# EAGLE design Energy meter12 (EAGLE 7.0.0)
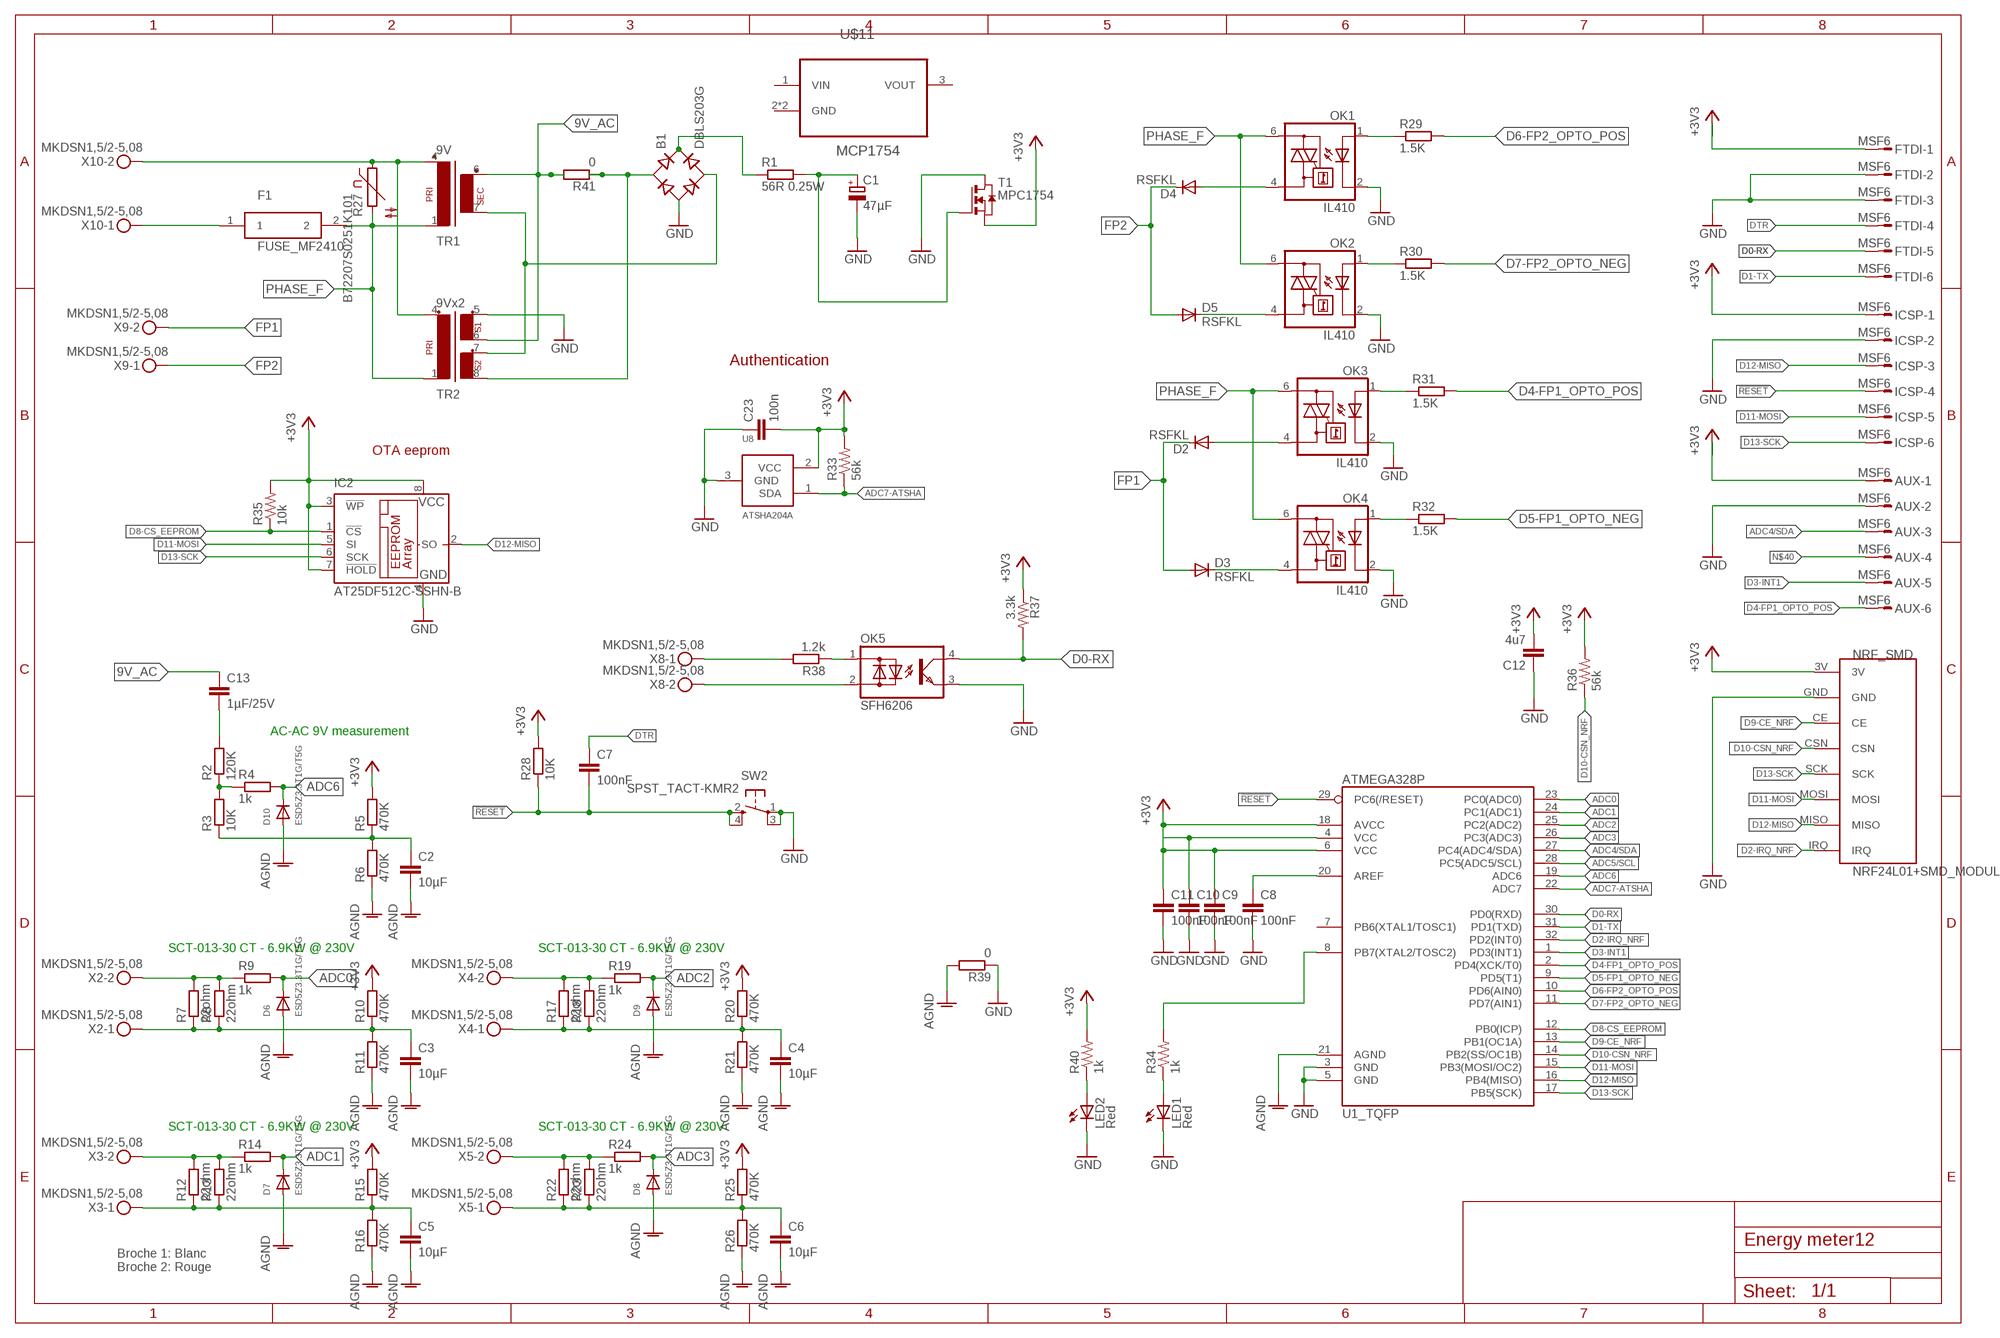
[diagram p0: schematic, sheet 1]

## Parts
AUX  MSF6  [MSF6]
B1  DBLS203G  [DBS]
C1  47µF  CPOL-EUD  [PANASONIC_D]
C2  10µF  C-EUC0805  [C0805]
C3  10µF  C-EUC0805  [C0805]
C4  10µF  C-EUC0805  [C0805]
C5  10µF  C-EUC0805  [C0805]
C6  10µF  C-EUC0805  [C0805]
C7  100nF  C-EUC0603  [C0603]
C8  100nF  C-EUC0603  [C0603]
C9  100nF  C-EUC0603  [C0603]
C10  100nF  C-EUC0603  [C0603]
C11  100nF  C-EUC0603  [C0603]
C12  4u7  CAP0805-CAP  [0805-CAP]
C13  1µF/25V  C-EUC0805  [C0805]
C23  100n  CAP0603-CAP  [0603-CAP]
D2  RSFKL  DIODE-SOD123  [SOD123]
D3  RSFKL  DIODE-SOD123  [SOD123]
D4  RSFKL  DIODE-SOD123  [SOD123]
D5  RSFKL  DIODE-SOD123  [SOD123]
D6  ESD5Z3.3T1G/T5G  DIODESOD-523  [SOD-523]
D7  ESD5Z3.3T1G/T5G  DIODESOD-523  [SOD-523]
D8  ESD5Z3.3T1G/T5G  DIODESOD-523  [SOD-523]
D9  ESD5Z3.3T1G/T5G  DIODESOD-523  [SOD-523]
D10  ESD5Z3.3T1G/T5G  DIODESOD-523  [SOD-523]
F1  FUSE_MF2410  [2410]
FTDI  MSF6  [MSF6]
IC2  AT25DF512C-SSHN-B  25AA080SN  [SO-08]
ICSP  MSF6  [MSF6]
LED1  Red  LED3MM  [LED3MM]
LED2  Red  LED3MM  [LED3MM]
NRF_SMD  NRF24L01+SMD_MODULE  [NRF24L01+SMD_MODULE]
OK1  IL410  [DIL06]
OK2  IL410  [DIL06]
OK3  IL410  [DIL06]
OK4  IL410  [DIL06]
OK5  SFH6206  [DIL4-SMD]
R1  56R 0.25W  R-EU_R1206  [R1206]
R2  120K  R-EU_R0603  [R0603]
R3  10K  R-EU_R0603  [R0603]
R4  1k  R-EU_R0603  [R0603]
R5  470K  R-EU_R0603  [R0603]
R6  470K  R-EU_R0603  [R0603]
R7  22ohm  R-EU_R1206  [R1206]
R8  22ohm  R-EU_0204/7  [0204/7]
R9  1k  R-EU_R0603  [R0603]
R10  470K  R-EU_R0603  [R0603]
R11  470K  R-EU_R0603  [R0603]
R12  22ohm  R-EU_R1206  [R1206]
R13  22ohm  R-EU_0204/7  [0204/7]
R14  1k  R-EU_R0603  [R0603]
R15  470K  R-EU_R0603  [R0603]
R16  470K  R-EU_R0603  [R0603]
R17  22ohm  R-EU_R1206  [R1206]
R18  22ohm  R-EU_0204/7  [0204/7]
R19  1k  R-EU_R0603  [R0603]
R20  470K  R-EU_R0603  [R0603]
R21  470K  R-EU_R0603  [R0603]
R22  22ohm  R-EU_R1206  [R1206]
R23  22ohm  R-EU_0204/7  [0204/7]
R24  1k  R-EU_R0603  [R0603]
R25  470K  R-EU_R0603  [R0603]
R26  470K  R-EU_R0603  [R0603]
R27  B72207S0251K101  [07S0251]
R28  10K  R-EU_R0603  [R0603]
R29  1.5K  R-EU_R0603  [R0603]
R30  1.5K  R-EU_R0603  [R0603]
R31  1.5K  R-EU_R0603  [R0603]
R32  1.5K  R-EU_R0603  [R0603]
R33  56k  RESISTOR0603-RES  [0603-RES]
R34  1k  RESISTOR0805-RES  [0805-RES]
R35  10k  RESISTOR0805-RES  [0805-RES]
R36  56k  RESISTOR0805-RES  [0805-RES]
R37  3.3k  RESISTOR0603-RES  [0603-RES]
R38  1.2k  R-EU_0204/7  [0204/7]
R39  0  R-EU_R0603  [R0603]
R40  1k  RESISTOR0805-RES  [0805-RES]
R41  0  R-EU_R0603  [R0603]
SW2  SPST_TACT-KMR2  [KMR2]
T1  MPC1754  NMOSSOT89  [SOT89]
TR1  9V  PT150901  [PT150901]
TR2  9Vx2  EE20-2  [EE20-2]
U1_TQFP  ATMEGA328P  ATMEGA328_SMT  [TQFP32-08]
U8  ATSHA204A  [SOT23]
U$11  MCP1754  [SOT89]
X2  MKDSN1,5/2-5,08  [MKDSN1,5/2-5,08]
X3  MKDSN1,5/2-5,08  [MKDSN1,5/2-5,08]
X4  MKDSN1,5/2-5,08  [MKDSN1,5/2-5,08]
X5  MKDSN1,5/2-5,08  [MKDSN1,5/2-5,08]
X8  MKDSN1,5/2-5,08  [MKDSN1,5/2-5,08]
X9  MKDSN1,5/2-5,08  [MKDSN1,5/2-5,08]
X10  MKDSN1,5/2-5,08  [MKDSN1,5/2-5,08]

## Nets
9V_AC: C13.1 R41.2 TR1.6(S3) TR2.6
!RESET: C7.2 ICSP.4 R28.1 SW2.2(S) SW2.4(S1) U1_TQFP.29(PC6(/RESET))
+3V3 [power]: AUX.1 C9.1 C10.1 C11.1 C12.2 C23.2 FTDI.1 IC2.3(!WP) IC2.7(!HOLD) IC2.8(VCC) ICSP.1 NRF_SMD.3V R5.2 R10.2 R15.2 R20.2 R25.2 R28.2 R33.2 R35.2 R36.2 R37.1 R40.2 T1.3(S) U1_TQFP.4(VCC) U1_TQFP.6(VCC) U1_TQFP.18(AVCC) U8.2(VCC)
ADC0: D6.K(C) R9.2 U1_TQFP.23(PC0(ADC0))
ADC1: D7.K(C) R14.2 U1_TQFP.24(PC1(ADC1))
ADC2: D9.K(C) R19.2 U1_TQFP.25(PC2(ADC2))
ADC3: D8.K(C) R24.2 U1_TQFP.26(PC3(ADC3))
ADC4/SDA: AUX.3 U1_TQFP.27(PC4(ADC4/SDA))
ADC5/SCL: U1_TQFP.28(PC5(ADC5/SCL))
ADC6: D10.K(C) R4.2 U1_TQFP.19(ADC6)
ADC7-ATSHA: R33.1 U1_TQFP.22(ADC7) U8.1(SDA)
AGND: C2.2 C3.2 C4.2 C5.2 C6.2 D6.A D7.A D8.A D9.A D10.A R6.1 R11.1 R16.1 R21.1 R26.1 R39.2 U1_TQFP.21(AGND)
D0-RX: FTDI.5 OK5.4(C) R37.2 U1_TQFP.30(PD0(RXD))
D1-TX: FTDI.6 U1_TQFP.31(PD1(TXD))
D2-IRQ_NRF: NRF_SMD.IRQ U1_TQFP.32(PD2(INT0))
D3-INT1: AUX.5 U1_TQFP.1(PD3(INT1))
D4-FP1_OPTO_POS: AUX.6 R31.2 U1_TQFP.2(PD4(XCK/T0))
D5-FP1_OPTO_NEG: R32.2 U1_TQFP.9(PD5(T1))
D6-FP2_OPTO_POS: R29.2 U1_TQFP.10(PD6(AIN0))
D7-FP2_OPTO_NEG: R30.2 U1_TQFP.11(PD7(AIN1))
D8-CS_EEPROM: IC2.1(!CS) R35.1 U1_TQFP.12(PB0(ICP))
D9-CE_NRF: NRF_SMD.CE U1_TQFP.13(PB1(OC1A))
D10-CSN_NRF: NRF_SMD.CSN R36.1 U1_TQFP.14(PB2(SS/OC1B))
D11-MOSI: IC2.5(SI) ICSP.5 NRF_SMD.MOSI U1_TQFP.15(PB3(MOSI/OC2))
D12-MISO: IC2.2(SO) ICSP.3 NRF_SMD.MISO U1_TQFP.16(PB4(MISO))
D13-SCK: IC2.6(SCK) ICSP.6 NRF_SMD.SCK U1_TQFP.17(PB5(SCK))
DTR: C7.1 FTDI.4
FP1 [220v]: D2.C D3.A X9.2
FP2 [220v]: D4.C D5.A X9.1
GND [gnd]: AUX.2 B1.- C1.- C8.2 C9.2 C10.2 C11.2 C12.1 C23.1 FTDI.2 FTDI.3 IC2.4(GND) ICSP.2 LED1.K(C) LED2.K(C) NRF_SMD.GND OK1.2(C) OK2.2(C) OK3.2(C) OK4.2(C) OK5.3(E) R39.1 SW2.1(P) SW2.3(P1) T1.2(D) T1.2@1(D) TR2.5 U1_TQFP.3(GND) U1_TQFP.5(GND) U8.3(GND)
N$1: B1.AC1 R41.1 TR2.8
N$2: C1.+ R1.2 T1.1(G)
N$3: R2.1 R3.2 R4.1
N$4: C2.1 R3.1 R5.1 R6.2
N$5 [220v]: D4.A OK1.4(A1)
N$6: R7.2 R8.2 R9.1 X2.2
N$7: C3.1 R7.1 R8.1 R10.1 R11.2 X2.1
N$8: LED2.A R40.1
N$9: R12.2 R13.2 R14.1 X3.2
N$10: C5.1 R12.1 R13.1 R15.1 R16.2 X3.1
N$11: R17.2 R18.2 R19.1 X4.2
N$12: C4.1 R17.1 R18.1 R20.1 R21.2 X4.1
N$13: R22.2 R23.2 R24.1 X5.2
N$14: C6.1 R22.1 R23.1 R25.1 R26.2 X5.1
N$15: C8.1 U1_TQFP.20(AREF)
N$16 [220v]: D2.A OK3.4(A1)
N$17 [220v]: D5.C OK2.4(A1)
N$18: OK1.1(A) R29.1
N$19: OK2.1(A) R30.1
N$20: R38.2 X8.1
N$21 [220v]: D3.C OK4.4(A1)
N$22: OK3.1(A) R31.1
N$23: OK4.1(A) R32.1
N$24: OK5.1(AC1) R38.1
N$25: OK5.2(AC2) X8.2
N$26: B1.+ R1.1
N$27: C13.2 R2.2
N$28: LED1.A R34.1
N$29: R34.2 U1_TQFP.8(PB7(XTAL2/TOSC2))
N$30 [220v]: R27.1 TR1.4(P2) TR2.4 X10.2
N$31 [gnd]: B1.AC2 TR1.7(S4) TR2.7
N$32 [220v]: F1.1 X10.1
N$40: AUX.4
PHASE_F [220v]: F1.2 OK1.6(A2) OK2.6(A2) OK3.6(A2) OK4.6(A2) R27.2 TR1.1 TR2.1
Unconnected: U1_TQFP.7(PB6(XTAL1/TOSC1)) U$11.1(VIN) U$11.2(GND) U$11.2.1(GND) U$11.3(VOUT)

## Notes on the sheet
- Authentication
- OTA eeprom
- AC-AC 9V measurement
- SCT-013-30 CT - 6.9KW @ 230V | SCT-013-30 CT - 6.9KW @ 230V
- SCT-013-30 CT - 6.9KW @ 230V | SCT-013-30 CT - 6.9KW @ 230V
- Broche 1: Blanc
  Broche 2: Rouge

## Library data of the parts
AUX FTDI ICSP = con-lumberg:MSF6: MSF CONNECTOR; OC_FARNELL: unknown; OC_NEWARK: unknown
B1 = rectifier:DB?*G: Single Phase 1.0 AMP Glass Passivated Bridge Rectifier Taiwan Semiconductor Co.,Ltd. - TSC Source: http://www.taiwansemi.com/TSCbig5/ezcatfiles/cust/img/img/db101g.pdf http://www.ts.com.tw/db/pictures/modules/PDT/PDT060207001/DBLS201G.pdf
C1 = rcl:CPOL-EU: POLARIZED CAPACITOR, European symbol
C2-C6 C13 = rcl:C-EU: CAPACITOR, European symbol
C7-C11 = resistor:C-EU: CAPACITOR, European symbol
C12 C23 = LowPowerLab:CAP: Capacitor Standard 0603 ceramic capacitor, and 0.1" leaded capacitor.
D2-D5 = diode:DIODE-: DIODE
D6-D10 = microbuilder:DIODE: Diode SMA Model Volts Amps Type Vf Vr Digikey # Notes SSA34-E3 40V 3A Schottky 480mV @ 3A 200uA @ 40V SSA34-E3/61TGITR-ND CDBA120-G 20V 1A Schottky 500mV @ 1A 500uA @ 20V 641-1014-6-ND REEL MBRA210 10V 2A Schottky 350mV @ 2A 700uA @ 10V MBRA210LT3 SOD-123 Model Volts Amps Type Vf Vr Order # Notes BAT54T1G 30V 200mA Schottky 800mV @ 200mA 2uA @ 25V BAT54T1GOSTR-ND B0530W 30V 500mA Schottky 430mV @ 500mA 130uA @ 30V B0530W-FDICT-ND REEL MBR120 1A 20V Schottky 340mV @ 1A MBR120VLSFT1GOSCT-ND SOD-323 Model Volts Amps Type Vf Vr Order # Notes PMEG2005EJ 20V 500mA Schottky 355mV @ 500mA 568-4110-1-ND ZLLS410 10V 570mA Schottky 380mV @ 570mA ZLLS410CT-ND 1N4148WS 75V 150mA Silicon/Simple 1V 1N4148WSFSCT-ND REEL SOD-523 Model Volts Amps Type Vf Vr Order # Notes BAT54XV2 30V 200mA Schottky 0.8V @ 100mA BAT54XV2CT-ND TB751S 30V 30mA Schottky RB751S-40TE61CT-ND SOT23-R/W (R = Solder Paste/Reflow Ovens, W = Hand-Soldering) Model Volts Amps Type Vf Vr Order # Notes BAT54FILM 40V 300mA Schottky 497-7162-1-ND
F1 = rollershutter:FUSE_MF2410
IC2 = microchip:25*: Serial EEPROM 4K/ 8K , SPI bus; MF: MICROCHIP; MPN: 25AA080/SN; OC_FARNELL: 1816072; OC_NEWARK: 92C7351
LED1 LED2 = led:LED: LED OSRAM: - CHIPLED LG R971, LG N971, LY N971, LG Q971, LY Q971, LO R971, LY R971 LH N974, LH R974 LS Q976, LO Q976, LY Q976 LO Q996 - Hyper CHIPLED LW Q18S LB Q993, LB Q99A, LB R99A - SideLED LS A670, LO A670, LY A670, LG A670, LP A670 LB A673, LV A673, LT A673, LW A673 LH A674 LY A675 LS A676, LA A676, LO A676, LY A676, LW A676 LS A679, LY A679, LG A679 - Hyper Micro SIDELED® LS Y876, LA Y876, LO Y876, LY Y876 LT Y87S - SmartLED LW L88C, LW L88S LB L89C, LB L89S, LG L890 LS L89K, LO L89K, LY L89K LS L896, LA L896, LO L896, LY L896 - TOPLED LS T670, LO T670, LY T670, LG T670, LP T670 LSG T670, LSP T670, LSY T670, LOP T670, LYG T670 LG T671, LOG T671, LSG T671 LB T673, LV T673, LT T673, LW T673 LH T674 LS T676, LA T676, LO T676, LY T676, LB T676, LH T676, LSB T676, LW T676 LB T67C, LV T67C, LT T67C, LS T67K, LO T67K, LY T67K, LW E67C LS E67B, LA E67B, LO E67B, LY E67B, LB E67C, LV E67C, LT E67C LW T67C LS T679, LY T679, LG T679 LS T770, LO T770, LY T770, LG T770, LP T770 LB T773, LV T773, LT T773, LW T773 LH T774 LS E675, LA E675, LY E675, LS T675 LS T776, LA T776, LO T776, LY T776, LB T776 LHGB T686 LT T68C, LB T68C - Hyper Mini TOPLED® LB M676 - Mini TOPLED Santana® LG M470 LS M47K, LO M47K, LY M47K Source: http://www.osram.convergy.de LUXEON: - LUMILED® LXK2-PW12-R00, LXK2-PW12-S00, LXK2-PW14-U00, LXK2-PW14-V00 LXK2-PM12-R00, LXK2-PM12-S00, LXK2-PM14-U00 LXK2-PE12-Q00, LXK2-PE12-R00, LXK2-PE12-S00, LXK2-PE14-T00, LXK2-PE14-U00 LXK2-PB12-K00, LXK2-PB12-L00, LXK2-PB12-M00, LXK2-PB14-N00, LXK2-PB14-P00, LXK2-PB14-Q00 LXK2-PR12-L00, LXK2-PR12-M00, LXK2-PR14-Q00, LXK2-PR14-R00 LXK2-PD12-Q00, LXK2-PD12-R00, LXK2-PD12-S00 LXK2-PH12-R00, LXK2-PH12-S00 LXK2-PL12-P00, LXK2-PL12-Q00, LXK2-PL12-R00 Source: www.luxeon.com KINGBRIGHT: KA-3528ASYC Source: www.kingbright.com
NRF_SMD = rollershutter:NRF24L01+SMD_MODULE
OK1-OK4 = optocoupler:IL410: SIEMENS OPTO COUPLER; MF: VISHAY/TELEFUNKEN; MPN: IL410; OC_FARNELL: 1045434; OC_NEWARK: 58K1715
OK5 = optocoupler-3-jcn:SFH620: Optocoupler, Phototransistor Output, AC Input Source: http://www.vishay.com/docs/83675/sfh620.pdf
R1 = resistor:R-EU_: RESISTOR, European symbol
R2-R26 R28-R32 R38 R39 R41 = rcl:R-EU_: RESISTOR, European symbol
R27 = Varistances:B72207S0251K101: VARISTOR
R33-R37 R40 = LowPowerLab:RESISTOR: Resistor Basic schematic elements and footprints for 0603, 1206, and PTH resistors.
SW2 = adafruit:SPST_TACT: SMT 6mm switch, EVQQ2 series http://www.ladyada.net/library/eagle
T1 = zetex:NMOSSOT89: MOS FET; OC_FARNELL: unknown; OC_NEWARK: unknown
TR1 = Transfo:PT150901: TRANSFORMER 1 primary winding, 1 secondary winding BLOCK; CONRAD: 1092836 - 62
TR2 = trafo:EE20-2: TRANSFORMER 1 primary winding, 2 secondary windings ERA
U1_TQFP = SparkFun-DigitalIC:ATMEGA328_SMT: 32-Pin Atmega328 part Commonly used on Arduino compatible boards Available in QFP and QFN packages TQFP is IC-09069 QFN is non-stock; PROD_ID: IC-09069
U8 = Multisensors_lib:ATSHA204A
U$11 = OpenEnergyMonitor:MCP1754
X2-X5 X8-X10 = con-phoenix-508:MKDSN1,5/2-5,08: MKDSN 1,5/ 2-5,08 Printklemme Nennstrom: 13,5 A Nennspannung: 250 V Rastermaß: 5,08 mm Polzahl: 2 Anschlussart: Schraubanschluss Montage: Löten Anschlussrichtung Leiter/Platine: 0 ° Artikelnummer: 1729128 Source: http://eshop.phoenixcontact.com .. 1729128.pdf

## Net classes
0 default: drill 0.015 mm, clearance 0.254 mm
1 power: width 0.305 mm, drill 0.6 mm, clearance 0.254 mm
2 gnd: width 0.305 mm, drill 0.6 mm, clearance 0.254 mm
3 220v: width 0.762 mm, drill 0.051 mm, clearance 0.762 mm

## Board
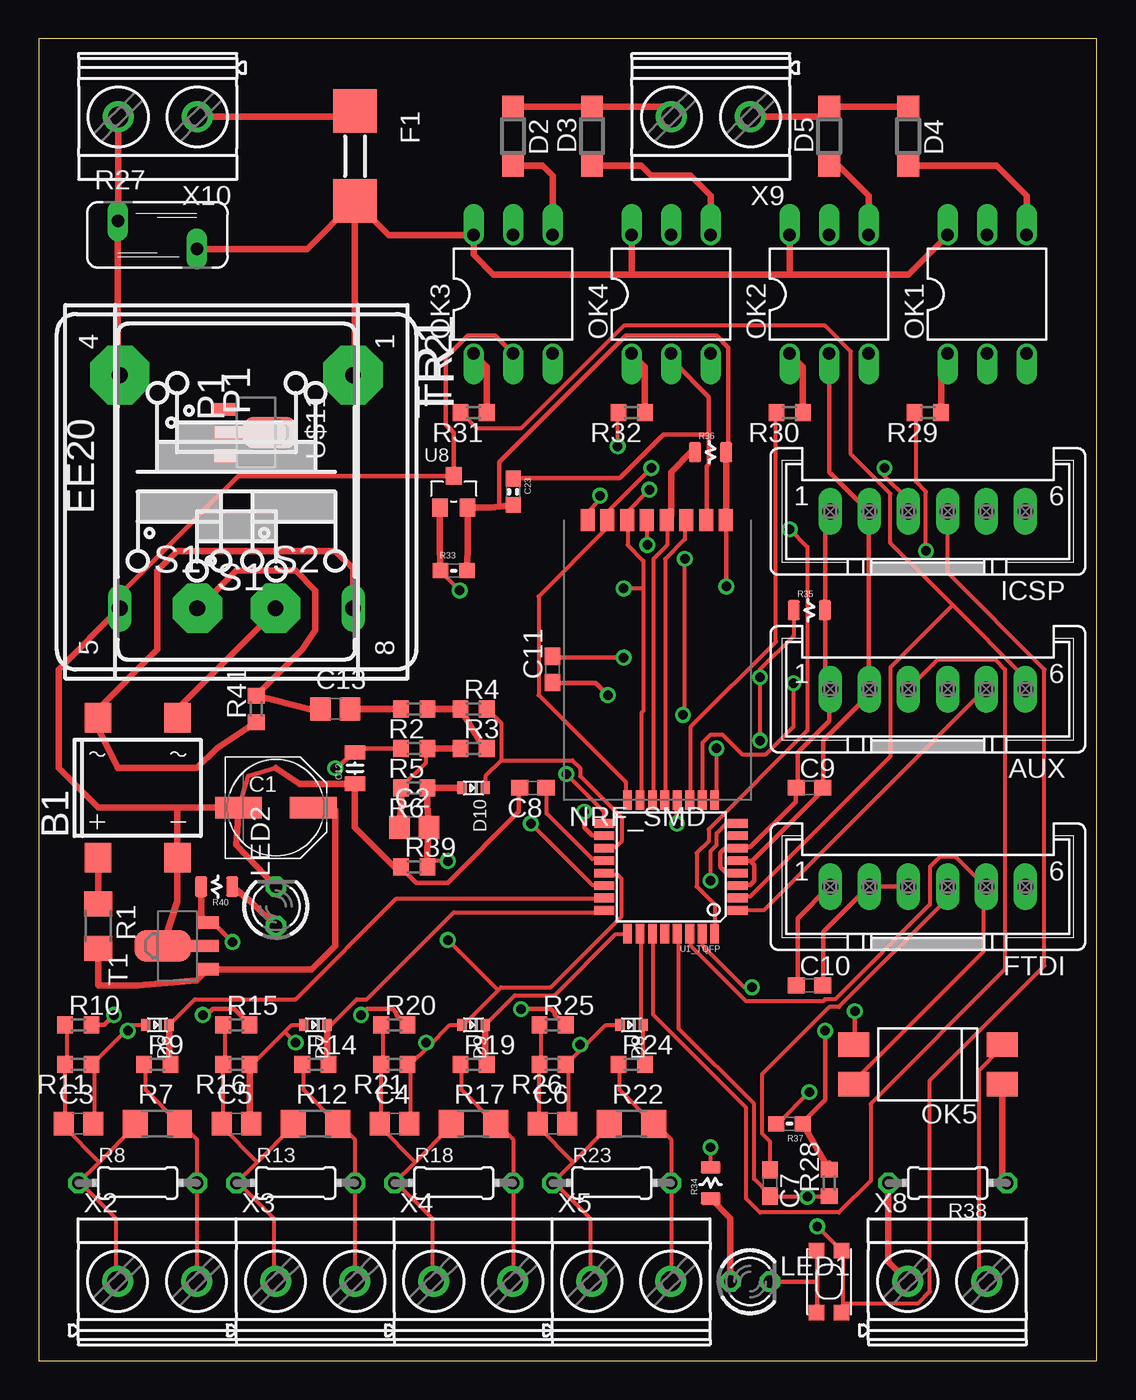
[diagram p1: board, top side]
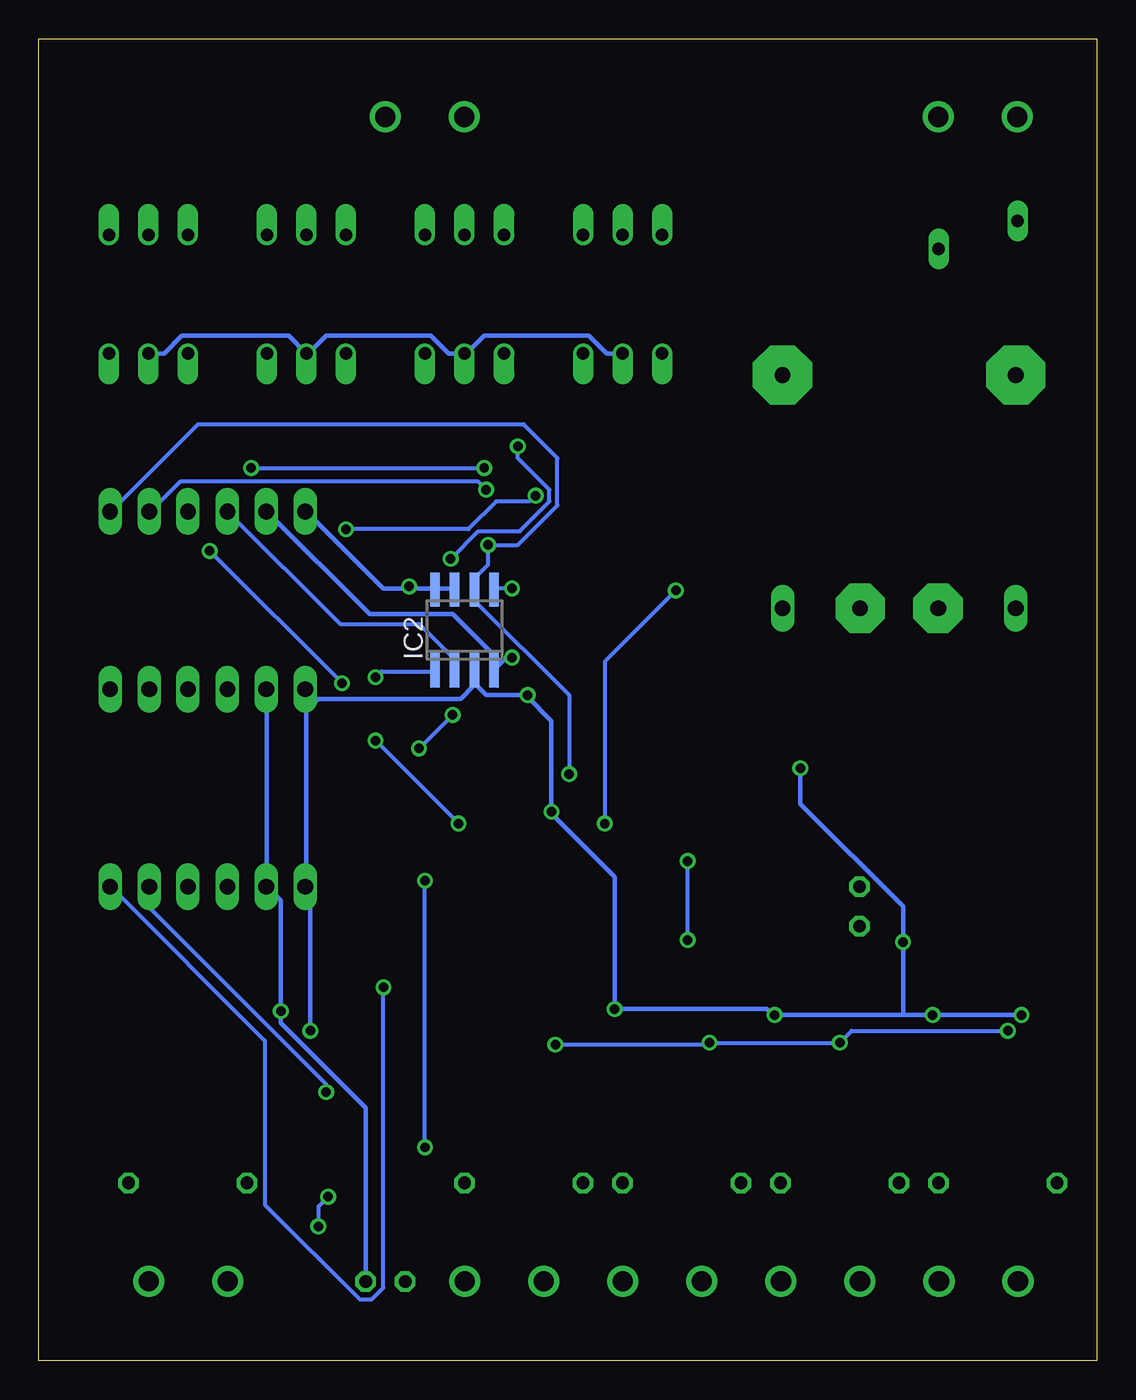
[diagram p2: board, bottom side, seen from below]

Size 68 x 85 mm. Coordinates in mm from the lower left corner, seen from the top.
Outline: 0,0 68,0 68,85 0,85 0,0
Copper layers (1*16): Top 0.035mm / dielectric 1.5mm / Bottom 0.035mm
Design rules "default *": minimum track width 10mil, minimum drill 24mil, track to track 8mil, track to pad 8mil, pad to pad 10mil, via to via 10mil, smd to smd 8mil, copper to edge 40mil, drill to drill 8mil, minimum pad ring 10mil, minimum via ring 8mil, stop-mask expansion 4mil, vias tented up to drill 0mil, thermal gap 10mil

### Footprints (pad centres in the part's own frame; a part is rotated, then mirrored left to right if it is on the bottom)
MSF6 = drill 1.016 long: 1 6.274,-2.54; 2 3.759,-2.54; 3 1.27,-2.54; 4 -1.27,-2.54; 5 -3.759,-2.54; 6 -6.274,-2.54
DBS = smd 1.7 x 1.9: + -2.55,-4.5; - 2.55,-4.5; AC1 -2.55,4.5; AC2 2.55,4.5
PANASONIC_D = smd 3 x 1.4: + 2.4,0; - -2.4,0
C0805 = smd 1.3 x 1.5: 1 -0.95,0; 2 0.95,0
C0603 = smd 1.1 x 1: 1 -0.85,0; 2 0.85,0
0805-CAP = smd 0.902 x 1.3: 1 -1,0; 2 1,0
0603-CAP = smd 1.016 x 0.965: 1 -0.85,0; 2 0.85,0
SOD123 = smd 1.4 x 1.4: A 1.9,0; C -1.9,0
SOD-523 = smd 0.8 x 0.6: A 0,-0.75; K 0,0.75
2410 = smd 2.8 x 2.8: 1 -2.9,0; 2 2.9,0
SO-08 = smd 0.6 x 2.2: 1 -1.905,-2.6; 2 -0.635,-2.6; 3 0.635,-2.6; 4 1.905,-2.6; 5 1.905,2.6; 6 0.635,2.6; 7 -0.635,2.6; 8 -1.905,2.6
LED3MM = drill 0.813 octagon: A -1.27,0; K 1.27,0
NRF24L01+SMD_MODULE = smd 0.9 x 1.4: 3V -4.8,-9.6; CE -2.26,-9.6; CSN -0.99,-9.6; GND -3.53,-9.6; IRQ 4.09,-9.6; MISO 2.82,-9.6; MOSI 1.55,-9.6; SCK 0.28,-9.6
DIL06 = drill 0.813 offset: 1 -2.54,-3.81; 2 0,-3.81; 3 2.54,-3.81; 4 2.54,3.81; 5 0,3.81; 6 -2.54,3.81
DIL4-SMD = smd 1.6 x 2: 1 -1.27,-4.77; 2 1.27,-4.77; 3 1.27,4.77; 4 -1.27,4.77
R1206 = smd 1.6 x 1.803: 1 -1.422,0; 2 1.422,0
R0603 = smd 1 x 1.1: 1 -0.85,0; 2 0.85,0
0204/7 = drill 0.813 octagon: 1 -3.81,0; 2 3.81,0
07S0251 = drill 0.8 long: 1 -0.9,-2.54; 2 0.9,2.54
0603-RES = smd 1.016 x 0.965: 1 -0.85,0; 2 0.85,0
0805-RES = smd 0.8 x 1.3: 1 -1,0; 2 1,0
KMR2 = smd 1 x 1: 1 2,0.8; 2 2,-0.8; 3 -2,0.8; 4 -2,-0.8
SOT89 = smd 0.8 x 1.4: 1 -1.499,-1.981; 3 1.499,-1.981 | smd 0.8 x 1.9: 2 0,-1.727 | smd 2.032 x 3.65: 2@1 0,0.94
PT150901 = drill 0.8 pad 3.81 octagon: 1 -7.5,7.5; 4 -7.5,-7.5 | drill 0.8 pad 3.175 octagon: 6 7.5,-2.5; 7 7.5,2.5
EE20-2 = drill 1.016 long: 1 -7.493,7.493; 4 -7.493,-7.493; 5 7.493,-7.493; 6 7.493,-2.515; 7 7.493,2.515; 8 7.493,7.493
TQFP32-08 = smd 1.27 x 0.559: 1 -4.293,2.8; 2 -4.293,2; 3 -4.293,1.2; 4 -4.293,0.4; 5 -4.293,-0.4; 6 -4.293,-1.2; 7 -4.293,-2; 8 -4.293,-2.8; 17 4.293,-2.8; 18 4.293,-2; 19 4.293,-1.2; 20 4.293,-0.4; 21 4.293,0.4; 22 4.293,1.2; 23 4.293,2; 24 4.293,2.8 | smd 0.559 x 1.27: 9 -2.8,-4.293; 10 -2,-4.293; 11 -1.2,-4.293; 12 -0.4,-4.293; 13 0.4,-4.293; 14 1.2,-4.293; 15 2,-4.293; 16 2.8,-4.293; 25 2.8,4.293; 26 2,4.293; 27 1.2,4.293; 28 0.4,4.293; 29 -0.4,4.293; 30 -1.2,4.293; 31 -2,4.293; 32 -2.8,4.293
SOT23 = smd 1.016 x 1.143: 1 -0.889,-1.016; 2 0.889,-1.016; 3 0,1.016
SOT89' = smd 0.8 x 1.4: 1 -1.499,-1.981; 3 1.499,-1.981 | smd 0.8 x 1.9: 2 0,-1.727 | smd 2 x 3.5: 2.1 0,0.889
MKDSN1,5/2-5,08 = drill 1.3 pad 2: 1 -2.561,0.025; 2 2.519,0.025

### Placement (x,y rotation side)
AUX  57.15,40.64 180 top
B1  6.35,36.83 0 top
C1  15.24,35.56 0 top
C2  24.13,34.29 0 top
C3  2.54,15.24 0 top
C4  22.86,15.24 0 top
C5  12.7,15.24 0 top
C6  33.02,15.24 0 top
C7  46.99,11.43 270 top
C8  31.75,36.83 180 top
C9  49.53,36.83 0 top
C10  49.53,24.13 0 top
C11  33.02,44.45 90 top
C12  20.32,38.1 90 top
C13  19.05,41.91 0 top
C23  30.48,55.88 270 top
D2  30.48,78.74 270 top
D3  35.56,78.74 90 top
D4  55.88,78.74 270 top
D5  50.8,78.74 90 top
D6  7.62,21.59 270 top
D7  17.78,21.59 270 top
D8  38.1,21.59 270 top
D9  27.94,21.59 270 top
D10  27.94,36.83 270 top
F1  20.32,77.47 270 top
FTDI  57.15,27.94 180 top
IC2  40.64,46.99 0 bottom
ICSP  57.15,52.07 180 top
LED1  45.72,5.08 0 top
LED2  15.24,29.21 90 top
NRF_SMD  39.37,44.45 180 top
OK1  60.96,68.58 0 top
OK2  50.8,68.58 0 top
OK3  30.48,68.58 0 top
OK4  40.64,68.58 0 top
OK5  57.15,19.05 90 top
R1  3.81,27.94 270 top
R2  24.13,41.91 180 top
R3  27.94,39.37 0 top
R4  27.94,41.91 0 top
R5  24.13,39.37 180 top
R6  24.13,36.83 180 top
R7  7.62,15.24 0 top
R8  6.35,11.43 0 top
R9  7.62,19.05 0 top
R10  2.54,21.59 0 top
R11  2.54,19.05 180 top
R12  17.78,15.24 0 top
R13  16.51,11.43 0 top
R14  17.78,19.05 0 top
R15  12.7,21.59 0 top
R16  12.7,19.05 180 top
R17  27.94,15.24 0 top
R18  26.67,11.43 0 top
R19  27.94,19.05 0 top
R20  22.86,21.59 0 top
R21  22.86,19.05 180 top
R22  38.1,15.24 0 top
R23  36.83,11.43 0 top
R24  38.1,19.05 0 top
R25  33.02,21.59 0 top
R26  33.02,19.05 180 top
R27  7.62,72.39 270 top
R28  50.8,11.43 90 top
R29  57.15,60.96 180 top
R30  48.26,60.96 180 top
R31  27.94,60.96 180 top
R32  38.1,60.96 180 top
R33  26.67,50.8 0 top
R34  43.18,11.43 90 top
R35  49.53,48.26 0 top
R36  43.18,58.42 0 top
R37  48.26,15.24 180 top
R38  58.42,11.43 180 top
R39  24.13,31.75 0 top
R40  11.43,30.48 180 top
R41  13.97,41.91 90 top
SW2  50.8,5.08 90 top
T1  8.89,26.67 90 top
TR1  12.7,55.88 270 top
TR2  12.7,55.88 270 top
U1_TQFP  40.64,31.75 180 top
U8  26.67,55.88 0 top
U$11  MCP1754  [SOT89']  13.97,59.69 270 top
X2  7.62,5.08 0 top
X3  17.78,5.08 0 top
X4  27.94,5.08 0 top
X5  38.1,5.08 0 top
X8  58.42,5.08 0 top
X9  43.18,80.01 180 top
X10  7.62,80.01 180 top

### Tracks (layer width: path | path; a pad name or v marks a point on that pad's centre or on a via)
9V_AC
  Top 0.254: TR2.6 10.29,48.39 TR1.6
  Top 0.406: TR1.6 10.28,48.38 10.29,48.39 12.7,50.8 16.51,50.8 17.78,49.53 17.78,46.99 16.93,45.72 R41.2 17.36,41.91 C13.1
!RESET  (via drill 0.61)
  Top 0.254: 51.69,3.68 51.69,6.99 SW2.2 51.56,7.11 v50.04,8.64 | 51.69,3.68 51.69,3.17 SW2.4 | R28.1 50.8,10.54 v49.4,10.54 46.99,10.54 C7.2 46.99,10.67 45.97,11.68 45.97,16.51 41.15,21.34 41.15,27.43 U1_TQFP.29 | ICSP.4 58.42,50.67 64.64,44.45 64.64,25.4 57.28,18.03 57.28,4.45 56.52,3.68 51.69,3.68
  Bottom 0.254: v50.04,8.64 50.04,9.91 v49.4,10.54
+3V3  (via drill 0.61)
  Top 0.305: R5.2 20.57,39.37 20.32,39.12 C12.2 20.19,39.12 19.18,38.1 v19.05,38.1 | R10.2 4.19,21.59 v4.83,22.23 | v10.54,22.23 10.79,22.23 11.18,22.61 12.57,22.61 13.59,21.59 R15.2 | v20.7,22.23 21.08,22.61 22.73,22.61 22.99,22.35 22.99,22.23 23.62,21.59 R20.2 | v30.99,22.61 32.89,22.61 33.15,22.35 33.15,22.23 33.78,21.59 R25.2 | v12.45,26.92 11.3,28.07 11.05,28.07 T1.3 | C10.1 48.77,24.13 48.77,28.45 50.8,30.48 FTDI.1 | v50.55,21.21 50.55,16.76 49.15,15.37 R37.1 | v36.58,42.8 35.81,43.56 33.02,43.56 C11.1 | v35.05,35.31 35.05,34.29 35.56,33.78 36.32,33.78 U1_TQFP.18 | U1_TQFP.4 44.83,31.37 44.2,31.37 43.81,31.75 43.81,32.64 44.07,32.89 44.83,32.89 U1_TQFP.6 44.96,33.02 45.72,33.02 48.64,35.94 48.64,36.83 C9.1 48.77,36.96 48.77,39.12 50.8,41.15 50.8,43.05 AUX.1 50.8,43.18 50.55,43.43 50.55,48.26 R35.2 50.55,48.39 50.55,54.36 50.8,54.61 ICSP.1 | v44.2,49.78 44.2,53.85 NRF_SMD.3V | 29.61,54.93 29.59,55.12 29.59,57.78 37.72,65.91 43.56,65.91 44.32,65.15 44.32,58.55 R36.2
  Top 0.406: 50.8,12.7 R28.2 R37.1 | R40.2 10.43,28.61 T1.3 | R33.2 27.56,52.11 U8.2 29.04,54.86 29.61,54.93 C23.2 | R36.2 NRF_SMD.3V
  Bottom 0.305: v4.83,22.23 v10.54,22.23 12.45,22.23 | 12.45,22.23 v20.7,22.23 20.83,22.23 21.21,22.61 v30.99,22.61 30.99,31.11 35.05,35.18 v35.05,35.31 35.05,41.15 36.58,42.67 v36.58,42.8 39.24,42.8 40.01,43.56 IC2.3 40.01,43.43 40.89,42.55 50.16,42.55 50.8,43.18 AUX.1 50.16,42.42 50.8,41.78 50.8,30.61 FTDI.1 50.8,30.48 50.55,30.23 v50.55,21.21 | 12.45,22.23 v12.45,26.92 12.45,29.21 19.05,35.81 v19.05,38.1 | IC2.7 41.27,49.66 42.55,49.66 IC2.8 42.67,49.66 44.2,49.66 | 44.2,49.66 45.85,49.66 50.8,54.61 ICSP.1 | v44.2,49.78 44.2,49.66
ADC0
  Top 0.254: U1_TQFP.23 36.32,29.72 22.99,29.72 16.51,23.24 10.03,23.24 8.51,21.72 D6.K
  Top 0.406: D6.K 8.37,19.15 R9.2
ADC1
  Top 0.254: U1_TQFP.24 36.32,28.83 26.67,28.83 21.08,23.24 20.45,23.24 18.67,21.46 D7.K
  Top 0.406: D7.K 18.53,19.15 R14.2
ADC2
  Top 0.254: U1_TQFP.25 37.72,27.43 37.08,27.43 33.15,23.5 30.61,23.5 28.83,21.72 D9.K
  Top 0.406: D9.K 28.69,19.15 R19.2
ADC3
  Top 0.254: R24.2 38.86,19.05 38.86,21.59 D8.K 38.73,21.59 38.73,27.43 U1_TQFP.26
ADC4/SDA
  Top 0.254: AUX.3 57.78,45.09 61.47,45.09 62.1,44.45 62.1,25.15 53.47,16.51 53.47,11.56 51.44,9.53 46.35,9.53 45.47,10.41 45.47,16.26 39.5,22.23 39.5,27.43 U1_TQFP.27
ADC6
  Top 0.254: 29.72,38.61 28.7,37.59 28.7,36.83 D10.K | 29.72,38.61 29.72,41.02 28.83,41.91 R4.2 | 29.72,38.61 34.29,38.61 34.8,38.1 34.8,37.59 37.47,34.92 37.47,33.4 37.08,33.02 36.45,33.02 U1_TQFP.19
ADC7-ATSHA  (via drill 0.61)
  Top 0.254: v31.62,34.54 35.56,30.61 36.32,30.61 U1_TQFP.22 | v27.05,49.53 25.91,50.67 R33.1
  Top 0.406: U8.1 25.78,52.11 R33.1
  Bottom 0.254: v31.62,34.54 31.62,44.96 v27.05,49.53
AGND  (via drill 0.61)
  Top 0.254: 23.88,19.05 23.88,15.24 C4.2 | D8.A 36.45,21.59 34.99,20.13 | 34.99,20.13 33.91,19.05 R26.1 34.04,19.05 34.04,15.24 C6.2 | 5.65,21.27 3.43,19.05 R11.1 3.56,19.05 3.56,15.24 C3.2 | 5.65,21.27 5.97,21.59 6.86,21.59 D6.A | D7.A 16.26,21.59 15.81,21.14 | 15.81,21.14 13.72,19.05 R16.1 | 23.88,19.05 25.08,20.26 | 25.08,20.26 26.42,21.59 D9.A 27.3,21.59 29.53,23.81 | 23.88,19.05 R21.1 | 29.53,23.81 29.72,24 32.89,24 37.47,28.57 37.47,30.99 37.21,31.24 36.45,31.24 U1_TQFP.21 | v16.51,20.45 15.81,21.14 | 25.08,20.26 v24.89,20.45 | v26.29,32.13 25.15,32.13 R39.2 | 29.53,23.81 v26.29,27.05 | v5.71,21.21 5.65,21.27 | v34.8,20.32 34.99,20.13
  Top 0.406: D10.A R6.1 24.98,35.66 C2.2 24.98,32.92 R39.2 | R16.1 13.55,15.34 C5.2
  Bottom 0.254: v26.29,27.05 v26.29,32.13 | v5.71,21.21 15.75,21.21 v16.51,20.45 v24.89,20.45 25.02,20.32 v34.8,20.32
D0-RX  (via drill 0.61)
  Top 0.254: v49.53,17.27 47.5,15.24 R37.2 | U1_TQFP.30 41.91,27.43 41.91,26.67 45.47,23.11 50.42,23.11 50.55,23.24 51.18,23.24 57.28,29.34 57.28,31.75 57.91,32.38 58.93,32.38 60.83,30.48 FTDI.5 60.71,30.48 60.71,26.29 52.45,18.03 52.45,17.78 OK5.4
  Bottom 0.254: v49.53,17.27 49.53,17.78 60.83,29.08 60.83,30.48 FTDI.5
D1-TX  (via drill 0.61)
  Top 0.254: v45.85,24 45.34,24 42.67,26.67 42.67,27.43 U1_TQFP.31
  Bottom 0.254: v45.85,24 45.85,4.7 46.61,3.94 47.37,3.94 53.47,10.03 53.47,20.57 63.37,30.48 FTDI.6
D2-IRQ_NRF  (via drill 0.61)
  Top 0.254: v48.26,53.47 49.4,52.32 49.4,40.51 43.05,34.16 43.05,33.4 42.29,32.64 42.29,30.48 43.43,29.34 43.43,27.56 U1_TQFP.32 | v36.07,55.63 36.07,55.37 35.31,54.61 35.31,54.1 NRF_SMD.IRQ
  Bottom 0.254: v48.26,53.47 40.39,53.47 38.61,55.24 36.45,55.24 v36.07,55.63
D3-INT1
  Top 0.254: U1_TQFP.1 44.96,28.96 46.61,28.96 60.83,43.18 AUX.5
D4-FP1_OPTO_POS
  Top 0.254: 58.74,48.58 63.37,43.94 63.37,43.18 AUX.6 | 58.74,48.58 54.74,52.58 54.74,55.75 52.2,58.29 52.2,64.9 50.55,66.55 37.59,66.55 30.99,59.94 28.19,59.94 27.18,60.96 R31.2 | 58.74,48.58 54.74,44.58 54.74,38.86 45.72,29.84 44.96,29.84 U1_TQFP.2
D5-FP1_OPTO_NEG  (via drill 0.61)
  Top 0.254: v37.21,58.8 37.21,60.96 R32.2 | v41.53,51.56 41.53,41.66 v41.4,41.53 | v43.56,39.37 43.56,36.07 U1_TQFP.9
  Bottom 0.254: v37.21,58.8 37.21,58.04 35.18,56.01 35.18,55.24 37.08,53.34 39.75,53.34 v41.53,51.56 | v43.56,39.37 v41.4,41.53
D6-FP2_OPTO_POS  (via drill 0.61)
  Top 0.254: v57.02,52.07 57.02,55.88 56.39,56.52 56.39,60.96 R29.2 | v48.51,43.56 48.51,40.77 46.74,38.99 45.21,38.99 43.94,40.26 43.18,40.26 42.67,39.75 42.67,36.07 U1_TQFP.10
  Bottom 0.254: v48.51,43.56 v57.02,52.07
D7-FP2_OPTO_NEG
  Top 0.254: R30.2 47.37,60.96 47.37,46.23 41.91,40.77 41.91,36.07 U1_TQFP.11
D8-CS_EEPROM  (via drill 0.61)
  Top 0.254: v41.02,34.54 41.02,35.94 U1_TQFP.12 | v46.35,39.88 v46.35,43.94 46.35,44.45 48.51,46.61 48.51,48.26 R35.1
  Bottom 0.254: v46.35,39.88 v41.02,34.54 | v46.35,43.94 45.97,44.32 42.55,44.32 IC2.1
D9-CE_NRF
  Top 0.254: U1_TQFP.13 40.26,36.07 40.26,51.56 41.53,52.83 41.53,53.98 NRF_SMD.CE
D10-CSN_NRF
  Top 0.254: U1_TQFP.14 39.5,36.07 39.5,51.56 40.39,52.45 40.39,53.85 NRF_SMD.CSN
  Top 0.406: R36.1 41.91,58.42 40.64,57.15 40.64,54.33 NRF_SMD.CSN
D11-MOSI  (via drill 0.61)
  Top 0.254: 38.86,49.66 38.86,51.44 37.85,52.45 37.85,53.98 NRF_SMD.MOSI 37.85,54.1 37.85,54.61 v39.24,56.01 | 38.86,49.66 38.86,41.78 38.73,41.66 38.73,36.07 U1_TQFP.15 | 38.86,49.66 v37.59,49.66
  Bottom 0.254: v37.59,49.66 38.73,49.66 IC2.5 | v39.24,56.01 39.75,56.52 58.93,56.52 60.83,54.61 ICSP.5
D12-MISO  (via drill 0.61)
  Top 0.254: U1_TQFP.16 37.72,36.07 37.72,37.21 32.13,42.8 32.13,49.15 36.45,53.47 36.45,53.98 NRF_SMD.MISO 36.58,54.1 36.58,54.61 v39.37,57.4 | v54.36,57.4 54.36,56.9 55.88,55.37 ICSP.3
  Bottom 0.254: IC2.2 41.27,45.09 43.56,47.37 48.64,47.37 ICSP.3 | v54.36,57.4 v39.37,57.4
D13-SCK  (via drill 0.61)
  Top 0.254: v33.91,37.72 36.32,35.31 36.32,34.67 U1_TQFP.17 | v39.12,52.45 39.12,53.98 NRF_SMD.SCK
  Bottom 0.254: v33.91,37.72 33.91,42.8 40.01,48.9 IC2.6 40.01,50.29 39.12,51.18 v39.12,52.45 37.21,52.45 34.67,54.99 34.67,58.04 36.83,60.2 57.78,60.2 63.37,54.61 ICSP.6
DTR
  Top 0.254: C7.1 46.99,14.1 46.48,14.61 46.48,18.41 50.8,22.73 51.44,22.73 58.42,29.72 FTDI.4
FP1
  Top 0.406: D2.C D3.A 40.01,80.64 X9.2
FP2
  Top 0.406: X9.1 50.15,79.98 D5.A D4.C
GND  (via drill 0.61)
  Top 0.305: 22.86,31.75 R39.1 23.37,31.62 24.26,30.73 26.29,30.73 30.86,35.31 30.86,36.83 C8.2 | 15.24,38.1 13.46,37.59 C1.- | 43.05,59.56 43.05,61.98 40.77,64.26 40.77,64.64 OK4.2 | 43.05,59.56 43.05,57.66 42.93,57.53 42.93,54.1 NRF_SMD.GND | OK3.2 29.34,65.91 27.56,65.91 26.16,64.52 26.16,60.2 26.67,59.69 U8.3 12.83,56.9 5.33,49.4 5.33,48.51 TR2.5 | 50.04,5.08 50.04,6.99 SW2.1 | 50.04,5.08 50.04,3.17 SW2.3 | LED1.K 50.04,5.08 | C10.2 50.42,24.13 50.42,27.56 53.34,30.48 FTDI.2 FTDI.3 | v52.45,22.48 52.45,20.32 OK5.3 | 45.78,32.07 45.72,32.13 44.96,32.13 U1_TQFP.5 | 45.78,32.07 45.97,31.88 45.97,30.86 45.72,30.61 44.96,30.61 U1_TQFP.3 | 45.78,32.07 50.42,36.7 C9.2 50.42,36.83 50.42,39.88 53.34,42.8 53.34,43.18 AUX.2 53.34,43.31 53.34,54.48 ICSP.2 53.34,54.61 50.8,57.15 OK2.2 | 43.05,59.56 40.13,59.56 37.34,56.77 30.48,56.77 C23.1 | v37.59,45.21 33.02,45.21 C11.2
  Top 0.406: TR2.5 1.27,44.45 1.27,38.1 3.81,35.56 7.62,35.56 | 7.62,35.56 C1.- 12.7,33.16 LED2.K | 7.62,35.56 8.9,35.55 B1.- 8.9,29.53 T1.2@1 | 15.24,38.1 16.78,37.1 C12.1 20.32,34.29 22.86,31.75
  Bottom 0.305: LED1.K 46.99,16.26 52.45,21.72 v52.45,22.48 52.45,29.59 53.34,30.48 FTDI.2 53.34,30.61 53.34,43.18 AUX.2 | v37.59,45.21 37.97,45.21 38.29,44.9 | 38.29,44.9 38.73,44.45 IC2.4 | OK1.2 59.94,64.77 58.8,65.91 51.94,65.91 OK2.2 50.67,64.77 49.53,65.91 42.8,65.91 41.66,64.77 OK4.2 40.51,64.77 39.37,65.91 32.64,65.91 31.5,64.77 OK3.2 | 38.29,44.9 41.4,48.01 46.74,48.01 53.34,54.61 ICSP.2
N$1
  Top 0.254: 3.81,41.91 3.81,41.53 B1.AC1
  Top 0.406: B1.AC1 3.8,40.65 5.08,38.1 10.16,38.1 11.43,39.37 R41.1 | TR2.8 20.19,50.93 19.05,52.07 8.89,52.07 7.62,50.8 7.62,45.72 3.81,41.91
N$2
  Top 0.406: R1.2 3.81,24.13 6.35,24.13 10.16,24.46 T1.1 17.55,25.17 19.05,26.67 19.05,35.42 C1.+
N$3
  Top 0.406: R2.1 R4.1 28.36,39.8 R3.2
N$4
  Top 0.254: R5.1 24.89,39.24 24.89,38.48 23.37,36.96 R6.2
  Top 0.406: R6.2 23.28,35.66 C2.1 | R3.1 R5.1
N$5
  Top 0.406: D4.A 61.59,76.84 63.5,74.93 OK1.4
N$6
  Top 0.254: R9.1 6.86,19.05 6.86,17.4 9.02,15.24 R7.2 9.14,15.24 10.16,14.22 R8.2 10.16,5.21 X2.2
N$7
  Top 0.254: R10.1 1.78,21.59 1.78,19.05 R11.2 1.65,19.05 1.65,15.24 | 3.87,12.76 R8.1 2.67,11.43 4.95,9.14 4.95,5.21 X2.1 | 3.87,12.76 6.1,14.99 6.1,15.24 R7.1 | 1.65,15.24 1.65,14.99 3.87,12.76 | 1.65,15.24 C3.1
N$8
  Top 0.406: R40.1 13.7,29.48 LED2.A
N$9
  Top 0.254: R14.1 17.02,19.05 17.02,17.4 19.18,15.24 R12.2 19.3,15.24 20.32,14.22 R13.2 20.32,5.21 X3.2
N$10
  Top 0.254: R15.1 11.94,21.59 11.94,19.05 R16.2 11.81,19.05 11.81,15.24 | 14.03,12.76 R13.1 12.83,11.43 15.11,9.14 15.11,5.21 X3.1 | 14.03,12.76 16.26,14.99 16.26,15.24 R12.1 | 11.81,15.24 11.81,14.99 14.03,12.76 | 11.81,15.24 C5.1
N$11
  Top 0.254: R19.1 27.18,19.05 27.18,17.4 29.34,15.24 R17.2 29.46,15.24 30.48,14.22 R18.2 30.48,5.21 X4.2
N$12
  Top 0.254: R20.1 22.1,21.59 22.1,19.05 R21.2 21.97,19.05 21.97,15.24 | 24.19,12.76 R18.1 22.99,11.43 25.27,9.14 25.27,5.21 X4.1 | 24.19,12.76 26.42,14.99 26.42,15.24 R17.1 | 21.97,15.24 21.97,14.99 24.19,12.76 | 21.97,15.24 C4.1
N$13
  Top 0.254: R24.1 37.34,19.05 37.34,17.4 39.5,15.24 R22.2 39.62,15.24 40.64,14.22 R23.2 40.64,5.21 X5.2
N$14
  Top 0.254: R25.1 32.26,21.59 32.26,19.05 R26.2 32.13,19.05 32.13,15.24 | 34.35,12.76 R23.1 33.15,11.43 35.43,9.14 35.43,5.21 X5.1 | 34.35,12.76 36.58,14.99 36.58,15.24 R22.1 | 32.13,15.24 32.13,14.99 34.35,12.76 | 32.13,15.24 C6.1
N$15
  Top 0.254: C8.1 32.64,36.83 32.64,35.18 35.56,32.26 36.32,32.26 U1_TQFP.20
N$16
  Top 0.406: D2.A 32.38,76.84 33.02,76.2 OK3.4
N$17
  Top 0.406: D5.C 51.43,76.84 53.34,74.93 OK2.4
N$18
  Top 0.406: R29.1 58,63.92 OK1.1
N$19
  Top 0.406: R30.1 49.11,63.92 OK2.1
N$20
  Top 0.406: R38.2 54.61,6.35 X8.1
N$21
  Top 0.406: D3.C 38.73,76.84 39.37,76.2 41.91,76.2 43.18,74.93 OK4.4
N$22
  Top 0.406: R31.1 28.79,63.92 OK3.1
N$23
  Top 0.406: R32.1 38.95,63.92 OK4.1
N$24
  Top 0.406: OK5.1 61.92,11.74 R38.1
N$25
  Top 0.254: OK5.2 61.85,20.32 61.85,20.07 60.45,18.67 60.45,5.59 60.83,5.21 X8.2
N$26
  Top 0.406: B1.+ 3.8,30.62 R1.1
N$27
  Top 0.406: C13.2 R2.2
N$28
  Top 0.406: LED1.A 44.45,9.16 R34.1
N$29  (via drill 0.61)
  Top 0.254: v43.18,30.86 43.18,32.77 43.56,33.15 43.56,33.91 44.2,34.54 44.83,34.54 U1_TQFP.8 | R34.2 v43.18,13.72
  Bottom 0.254: v43.18,13.72 v43.18,30.86
N$30
  Top 0.406: 5.1,63.48 TR2.4 5.08,63.5 R27.1 5.1,73.31 X10.2
  Top 0.762: TR2.4 TR1.4
N$31
  Top 0.305: 8.89,41.91 8.89,41.4 B1.AC2 | TR2.7 15.24,48.39 TR1.7
  Top 0.406: TR2.7 15.21,48.23 8.89,41.91
N$32
  Top 0.406: X10.1 19.93,79.98 F1.1
PHASE_F
  Top 0.406: R27.2 17.24,71.49 F1.2 | F1.2 20.32,63.5 TR1.1 | F1.2 22.5,72.39 OK3.6 27.94,71.12 29.21,69.85 38.1,69.85 | OK4.6 38.1,69.85 | 38.1,69.85 48.26,69.85 | OK2.6 48.26,69.85 | 48.26,69.85 55.88,69.85 OK1.6
  Top 0.762: TR2.1 TR1.1